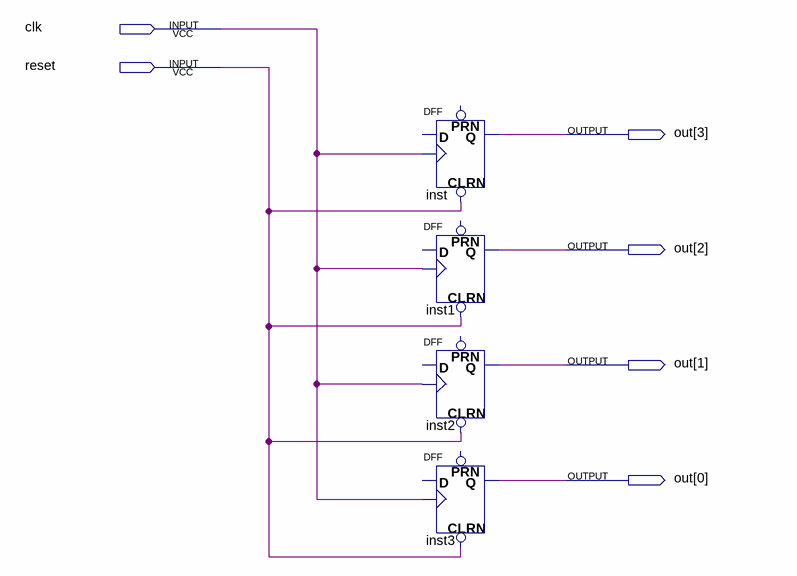
[diagram p0: schematic sheet]
// Quartus schematic syncDown.bdf as structural Verilog: 4 symbols, 6 pins
module syncDown (
  input  clk,
  input  reset,
  output [3:0] out
);

  DFF inst (.CLRN(reset), .CLK(clk), .Q(out[3]));  // open: D, PRN
  DFF inst1 (.CLRN(reset), .CLK(clk), .Q(out[2]));  // open: D, PRN
  DFF inst2 (.CLRN(reset), .CLK(clk), .Q(out[1]));  // open: D, PRN
  DFF inst3 (.CLRN(reset), .CLK(clk), .Q(out[0]));  // open: D, PRN
endmodule
